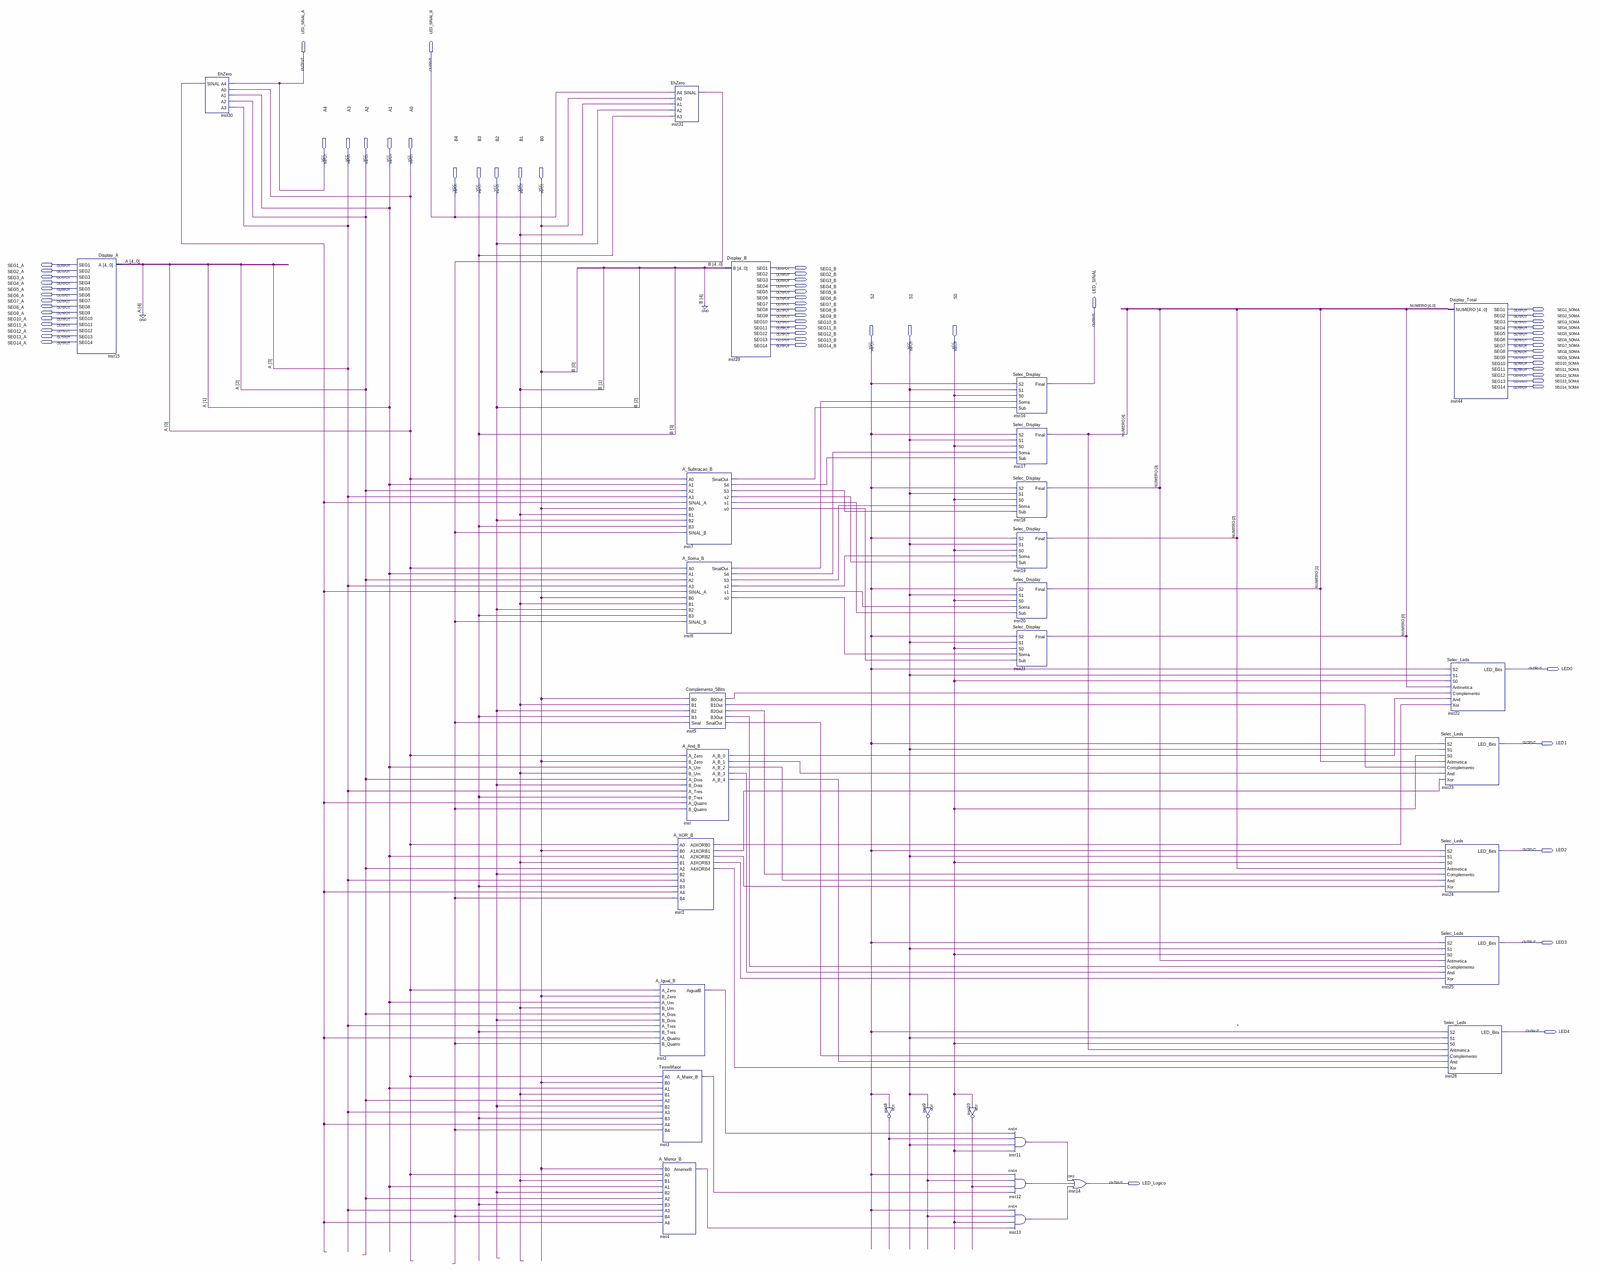
[diagram p0: schematic sheet, whole]
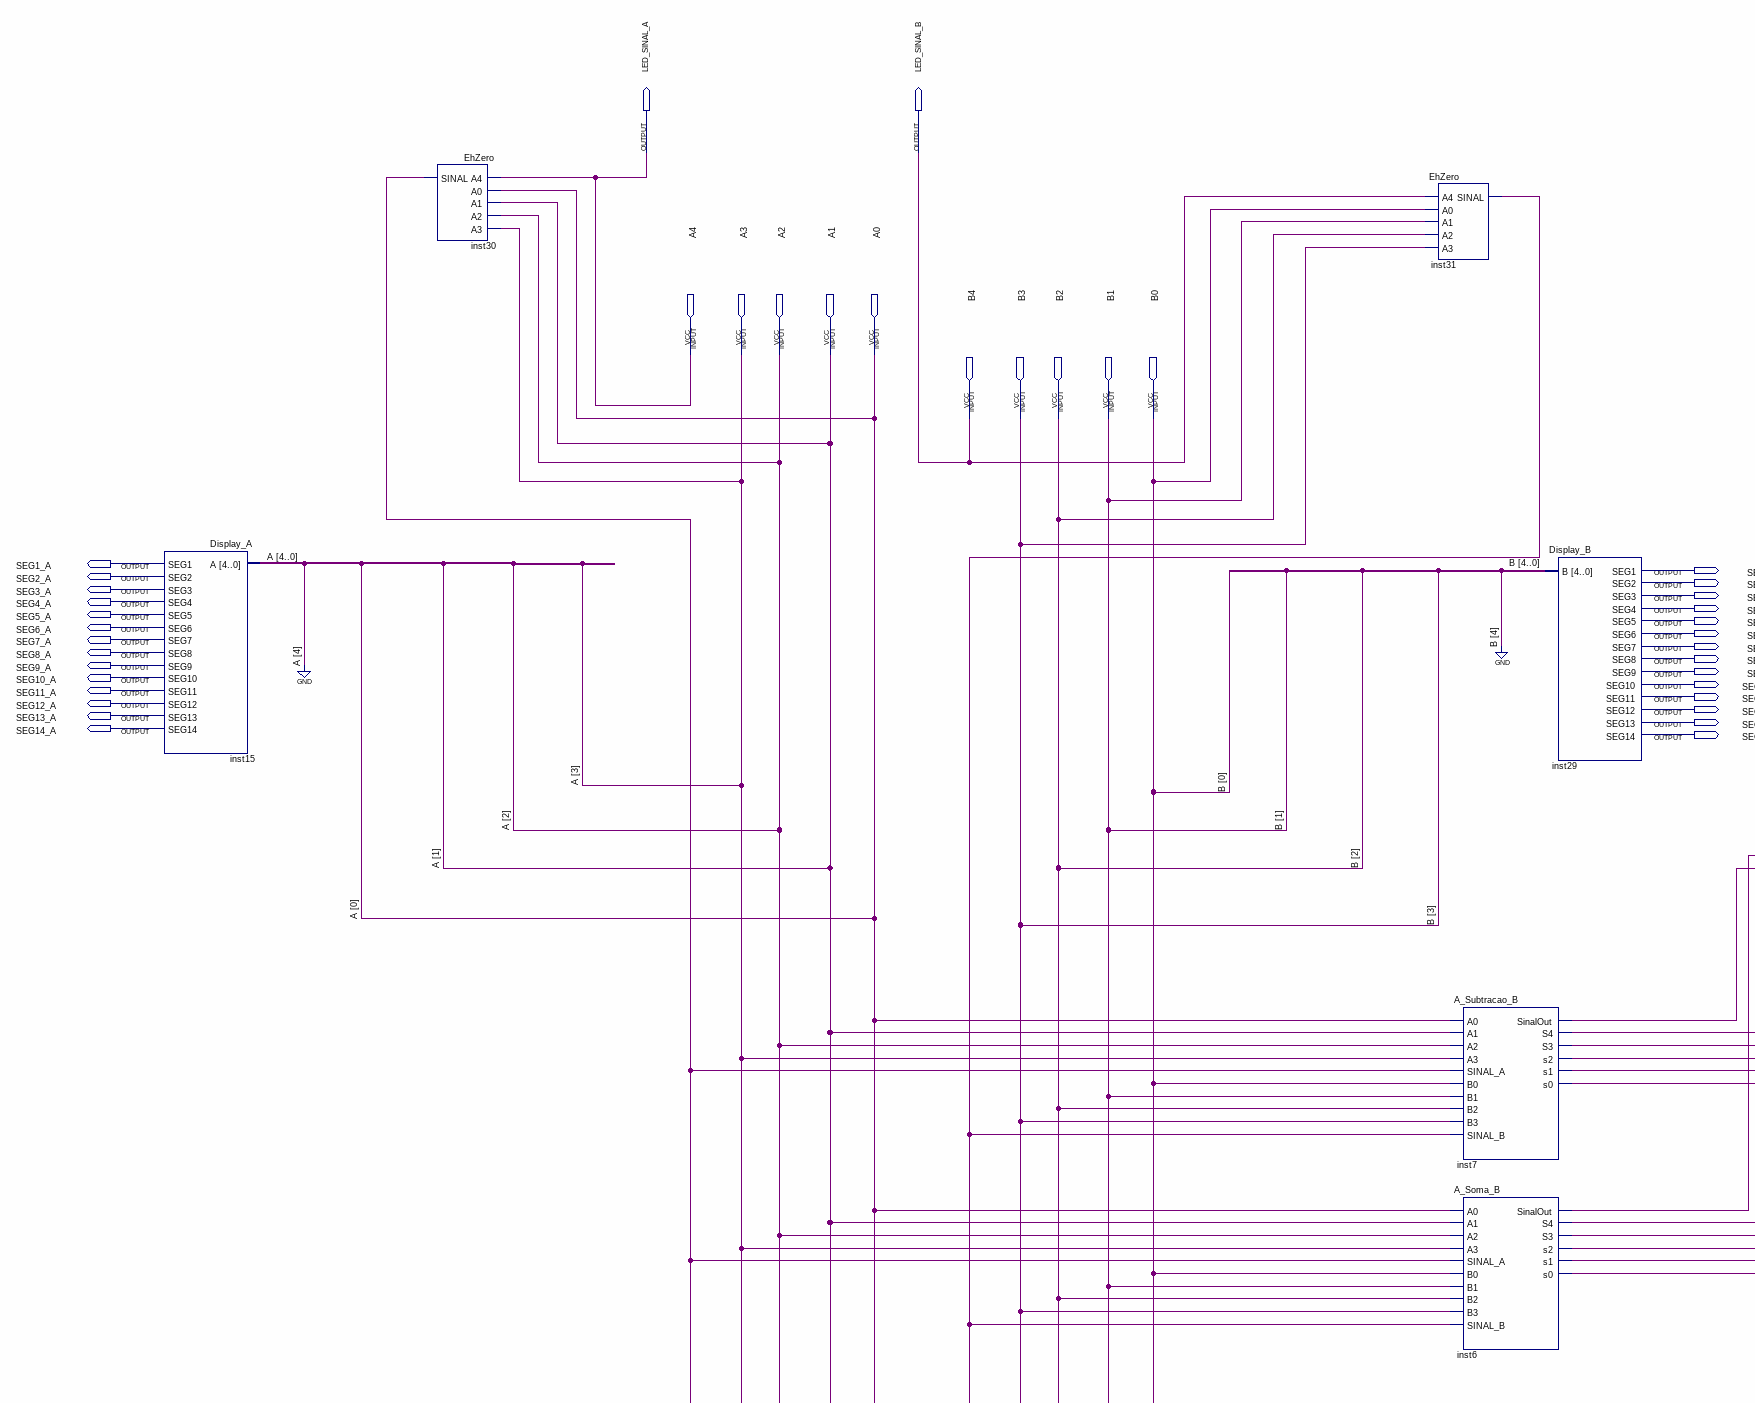
[diagram p1: schematic sheet, upper left part]
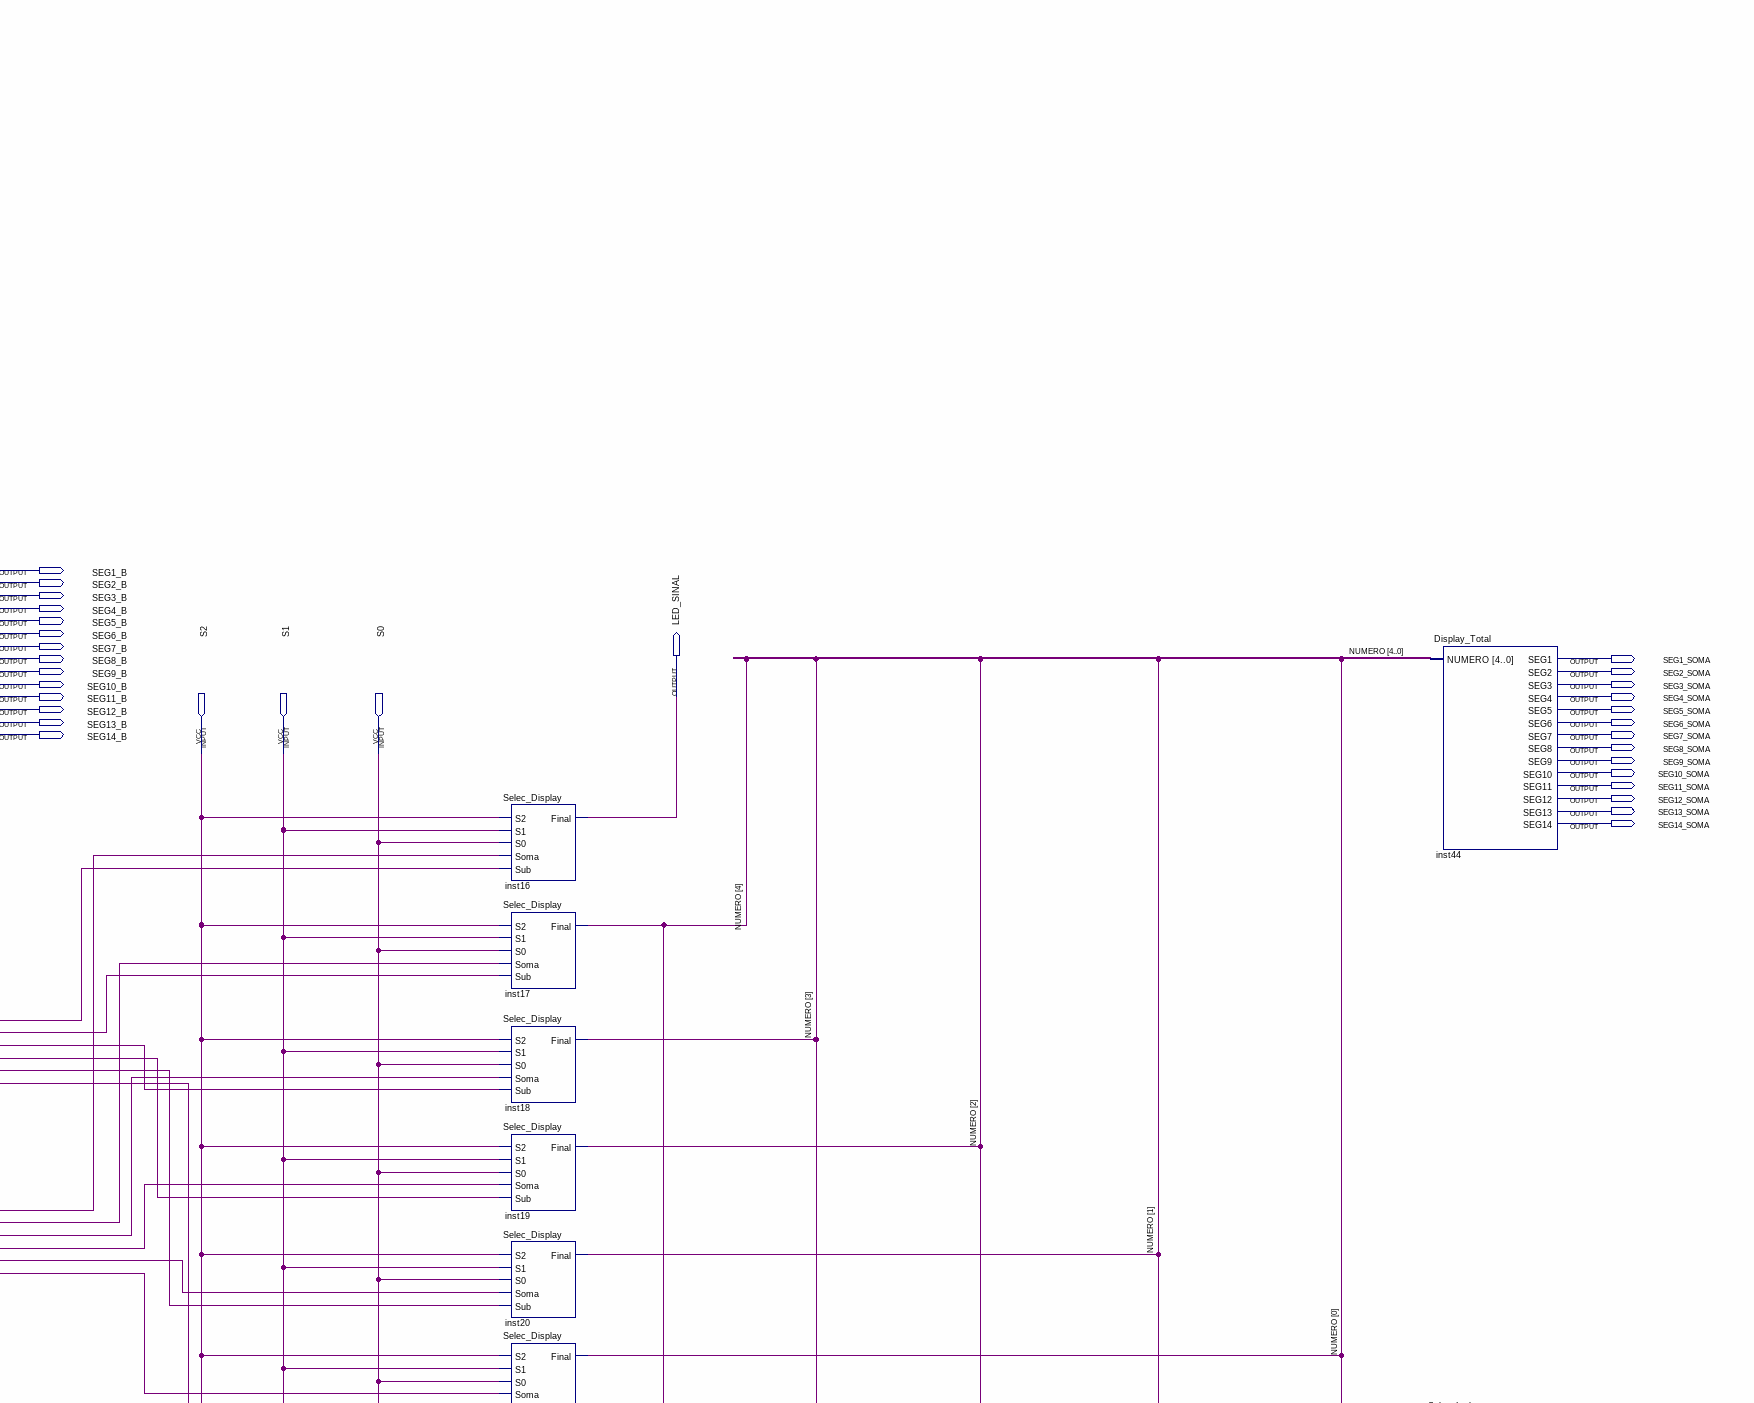
[diagram p2: schematic sheet, upper right part]
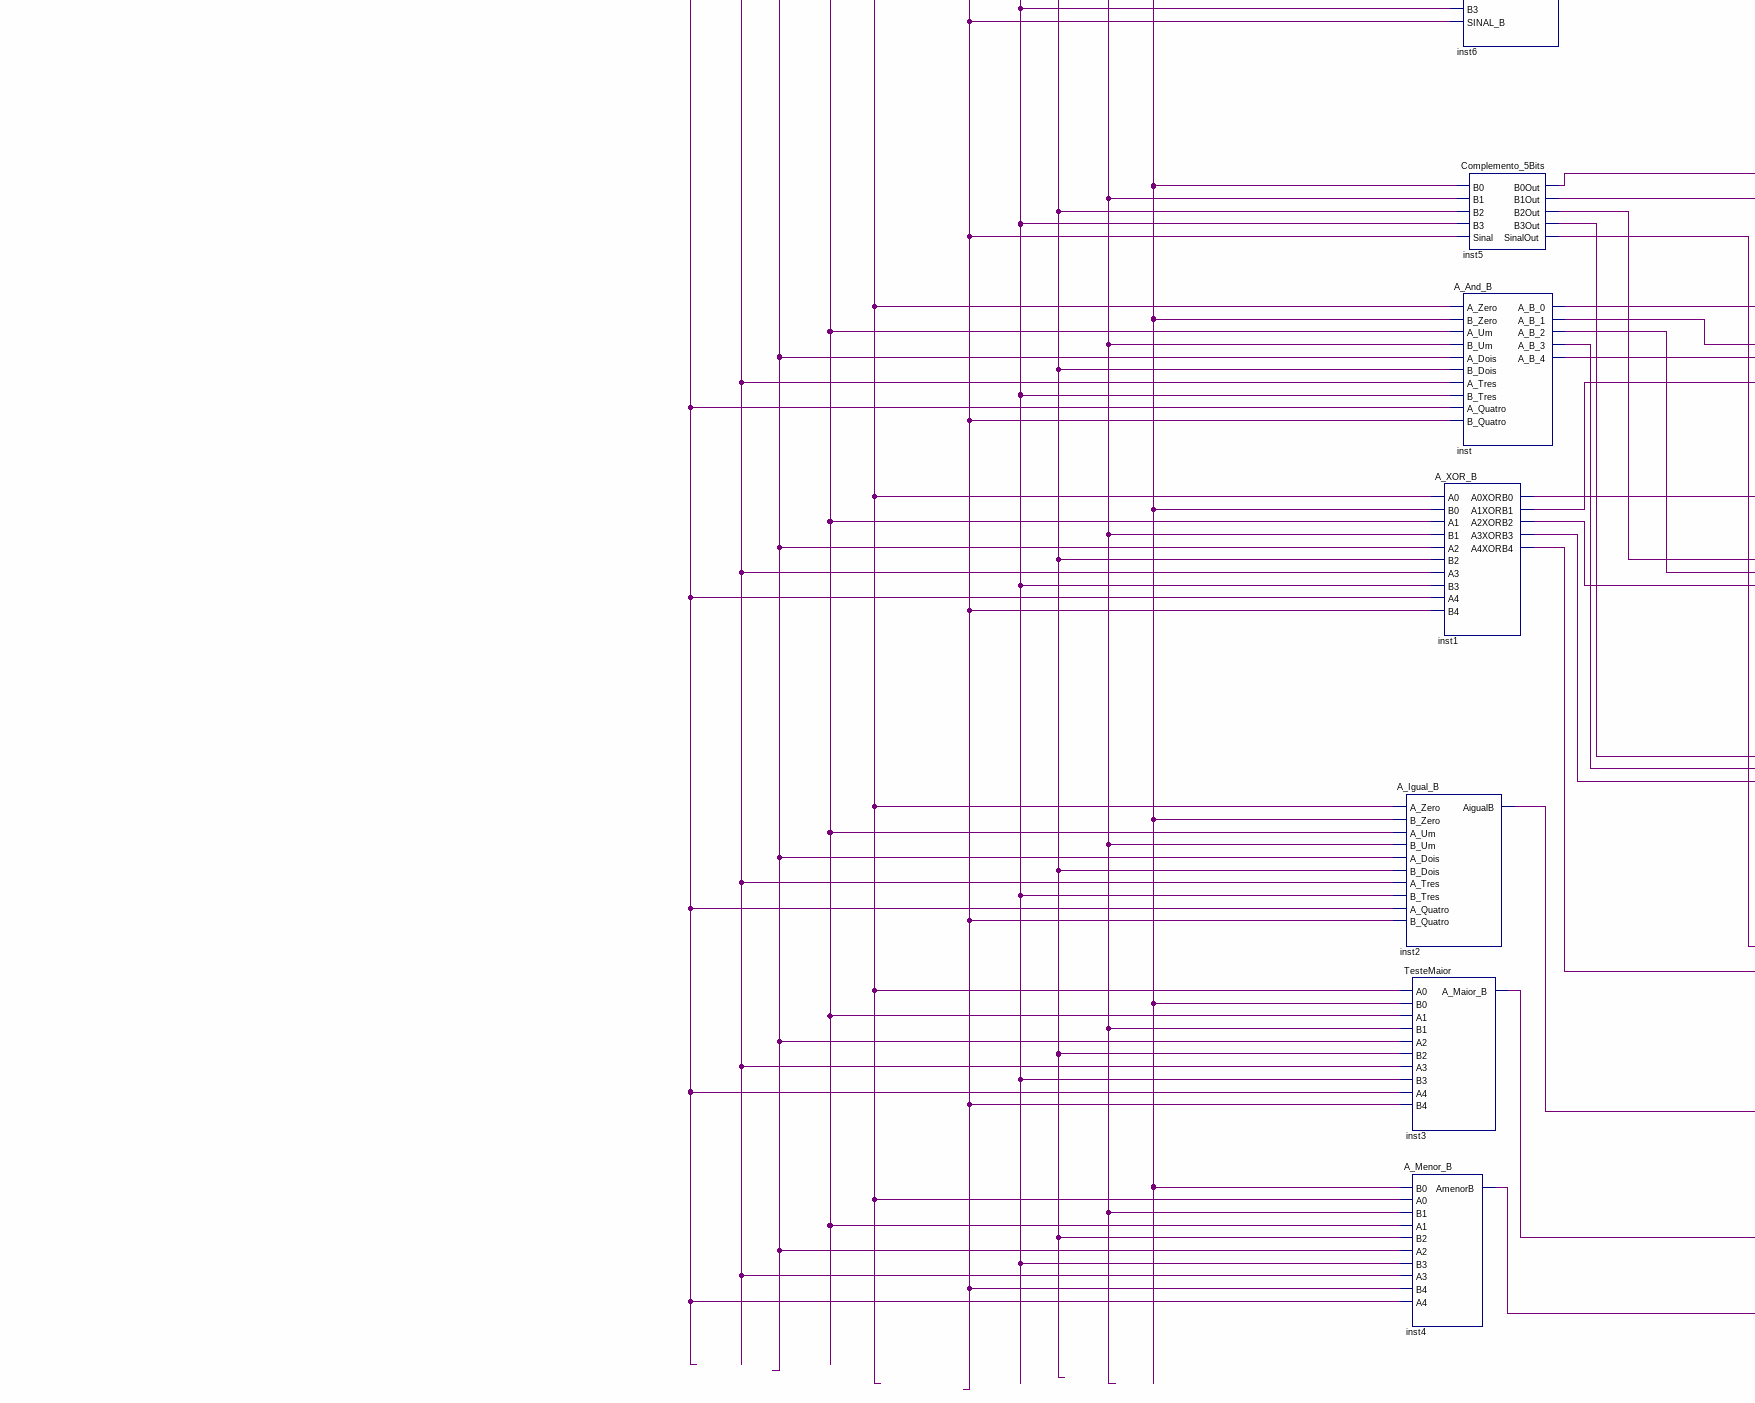
[diagram p3: schematic sheet, lower left part]
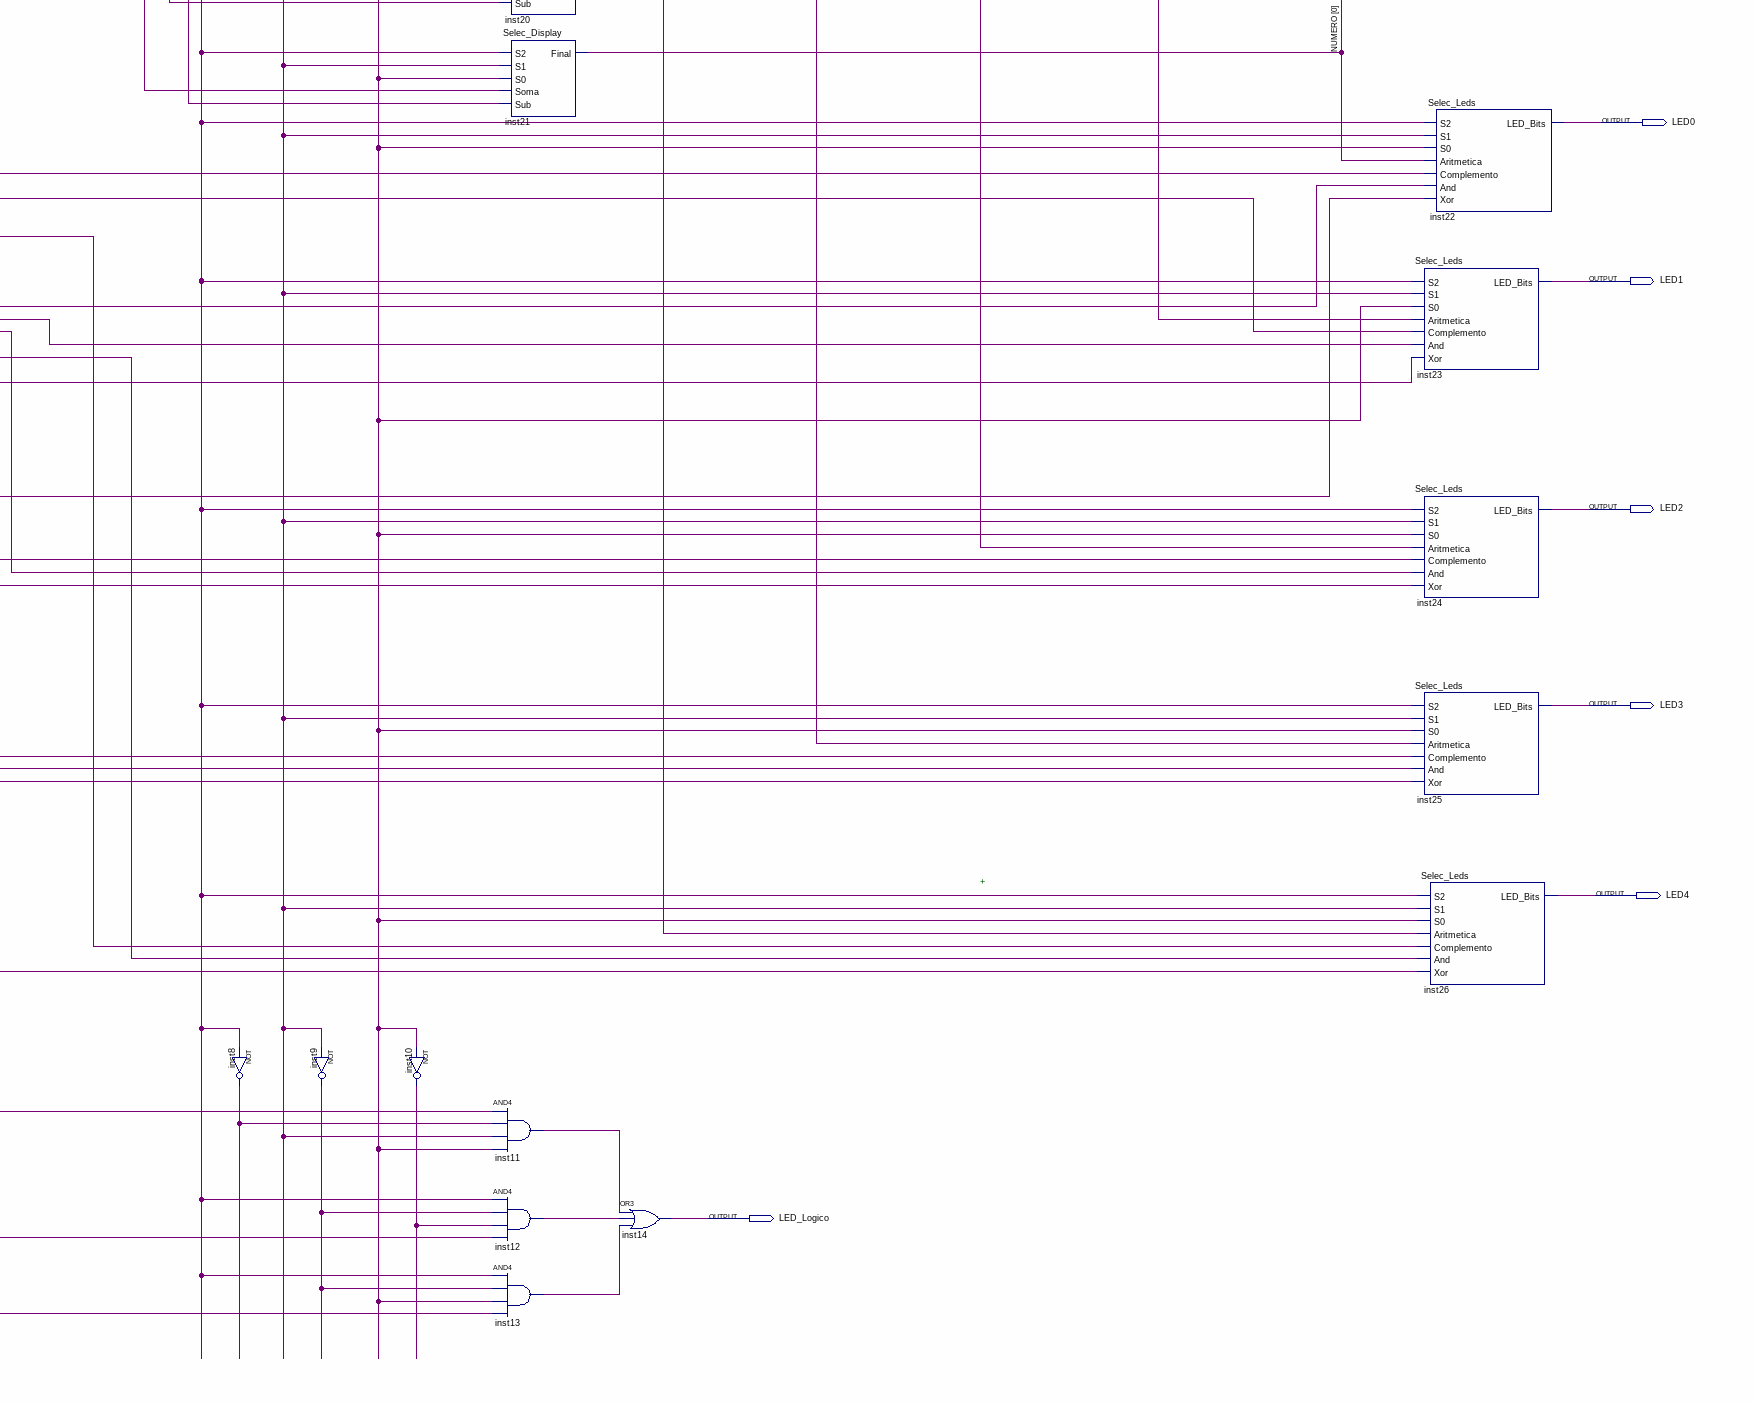
[diagram p4: schematic sheet, lower right part]
// Quartus schematic ULA.bdf as structural Verilog: 31 symbols, 64 pins
module ULA (
  input  A4,
  input  A3,
  input  A2,
  input  A1,
  input  A0,
  input  B4,
  input  B3,
  input  B2,
  input  B1,
  input  B0,
  input  S2,
  input  S1,
  input  S0,
  output LED_SINAL_A,
  output LED_SINAL_B,
  output SEG1_A,
  output SEG1_B,
  output SEG2_A,
  output SEG2_B,
  output SEG3_A,
  output SEG3_B,
  output SEG4_A,
  output SEG4_B,
  output SEG5_A,
  output SEG5_B,
  output SEG6_A,
  output SEG6_B,
  output SEG7_A,
  output SEG7_B,
  output SEG8_A,
  output SEG8_B,
  output SEG1_SOMA,
  output SEG9_A,
  output SEG9_B,
  output SEG2_SOMA,
  output SEG10_A,
  output SEG10_B,
  output SEG3_SOMA,
  output SEG11_A,
  output SEG11_B,
  output LED_SINAL,
  output SEG4_SOMA,
  output SEG12_A,
  output SEG12_B,
  output SEG5_SOMA,
  output SEG13_A,
  output SEG13_B,
  output SEG6_SOMA,
  output SEG14_A,
  output SEG14_B,
  output SEG7_SOMA,
  output SEG8_SOMA,
  output SEG9_SOMA,
  output SEG10_SOMA,
  output SEG11_SOMA,
  output SEG12_SOMA,
  output SEG13_SOMA,
  output SEG14_SOMA,
  output LED0,
  output LED1,
  output LED2,
  output LED3,
  output LED4,
  output LED_Logico
);

  wire inst1_a0xorb0, inst1_a1xorb1, inst1_a2xorb2, inst1_a3xorb3, inst1_a4xorb4, inst2_aigualb,
       inst3_a_maior_b, inst4_amenorb, inst5_b0out, inst5_b1out, inst5_b2out, inst5_b3out, inst5_sinalout,
       inst6_s0, inst6_s1, inst6_s2, inst6_s3, inst6_s4, inst6_sinalout, inst7_s0, inst7_s1, inst7_s2,
       inst7_s3, inst7_s4, inst7_sinalout, inst8_out, inst9_out, inst10_out, inst11_out, inst12_out,
       inst13_out, inst30_sinal, inst31_sinal, inst_a_b_0, inst_a_b_1, inst_a_b_2, inst_a_b_3, inst_a_b_4;
  wire [4:0] NUMERO;

  Display_A inst15 (
    .A({A4, A3, A2, A1, A0}), .SEG1(SEG1_A), .SEG2(SEG2_A), .SEG3(SEG3_A), .SEG4(SEG4_A), .SEG5(SEG5_A),
    .SEG6(SEG6_A), .SEG7(SEG7_A), .SEG8(SEG8_A), .SEG9(SEG9_A), .SEG10(SEG10_A), .SEG11(SEG11_A),
    .SEG12(SEG12_A), .SEG13(SEG13_A), .SEG14(SEG14_A));
  EhZero inst30 (.A4(A4), .A0(A0), .A1(A1), .A2(A2), .A3(A3), .SINAL(inst30_sinal));
  EhZero inst31 (.A4(B4), .A0(B0), .A1(B1), .A2(B2), .A3(B3), .SINAL(inst31_sinal));
  A_XOR_B inst1 (
    .A0(A0), .B0(B0), .A1(A1), .B1(B1), .A2(A2), .B2(B2), .A3(A3), .B3(B3), .A4(inst30_sinal),
    .B4(inst31_sinal), .A0XORB0(inst1_a0xorb0), .A1XORB1(inst1_a1xorb1), .A2XORB2(inst1_a2xorb2),
    .A3XORB3(inst1_a3xorb3), .A4XORB4(inst1_a4xorb4));
  A_Igual_B inst2 (
    .A_Zero(A0), .B_Zero(B0), .A_Um(A1), .B_Um(B1), .A_Dois(A2), .B_Dois(B2), .A_Tres(A3), .B_Tres(B3),
    .A_Quatro(inst30_sinal), .B_Quatro(inst31_sinal), .AigualB(inst2_aigualb));
  TesteMaior inst3 (
    .A0(A0), .B0(B0), .A1(A1), .B1(B1), .A2(A2), .B2(B2), .A3(A3), .B3(B3), .A4(inst30_sinal),
    .B4(inst31_sinal), .A_Maior_B(inst3_a_maior_b));
  A_Menor_B inst4 (
    .B0(B0), .A0(A0), .B1(B1), .A1(A1), .B2(B2), .A2(A2), .B3(B3), .A3(A3), .B4(inst31_sinal),
    .A4(inst30_sinal), .AmenorB(inst4_amenorb));
  A_Subtracao_B inst7 (
    .A0(A0), .A1(A1), .A2(A2), .A3(A3), .SINAL_A(inst30_sinal), .B0(B0), .B1(B1), .B2(B2), .B3(B3),
    .SINAL_B(inst31_sinal), .SinalOut(inst7_sinalout), .S4(inst7_s4), .S3(inst7_s3), .s2(inst7_s2),
    .s1(inst7_s1), .s0(inst7_s0));
  A_Soma_B inst6 (
    .A0(A0), .A1(A1), .A2(A2), .A3(A3), .SINAL_A(inst30_sinal), .B0(B0), .B1(B1), .B2(B2), .B3(B3),
    .SINAL_B(inst31_sinal), .SinalOut(inst6_sinalout), .S4(inst6_s4), .S3(inst6_s3), .s2(inst6_s2),
    .s1(inst6_s1), .s0(inst6_s0));
  Complemento_5Bits inst5 (
    .B0(B0), .B1(B1), .B2(B2), .B3(B3), .Sinal(inst31_sinal), .B0Out(inst5_b0out), .B1Out(inst5_b1out),
    .B2Out(inst5_b2out), .B3Out(inst5_b3out), .SinalOut(inst5_sinalout));
  A_And_B inst (
    .A_Zero(A0), .B_Zero(B0), .A_Um(A1), .B_Um(B1), .A_Dois(A2), .B_Dois(B2), .A_Tres(A3), .B_Tres(B3),
    .A_Quatro(inst30_sinal), .B_Quatro(inst31_sinal), .A_B_0(inst_a_b_0), .A_B_1(inst_a_b_1),
    .A_B_2(inst_a_b_2), .A_B_3(inst_a_b_3), .A_B_4(inst_a_b_4));
  Display_B inst29 (
    .B({B4, B3, B2, B1, B0}), .SEG1(SEG1_B), .SEG2(SEG2_B), .SEG3(SEG3_B), .SEG4(SEG4_B), .SEG5(SEG5_B),
    .SEG6(SEG6_B), .SEG7(SEG7_B), .SEG8(SEG8_B), .SEG9(SEG9_B), .SEG10(SEG10_B), .SEG11(SEG11_B),
    .SEG12(SEG12_B), .SEG13(SEG13_B), .SEG14(SEG14_B));
  not inst8 (inst8_out, S2);
  not inst9 (inst9_out, S1);
  not inst10 (inst10_out, S0);
  and inst11 (inst11_out, inst2_aigualb, inst8_out, S1, S0);
  and inst12 (inst12_out, S2, inst9_out, inst10_out, inst3_a_maior_b);
  and inst13 (inst13_out, S2, inst9_out, S0, inst4_amenorb);
  Selec_Display inst16 (.S2(S2), .S1(S1), .S0(S0), .Soma(inst6_sinalout), .Sub(inst7_sinalout), .Final(LED_SINAL));
  Selec_Display inst17 (.S2(S2), .S1(S1), .S0(S0), .Soma(inst6_s4), .Sub(inst7_s4), .Final(NUMERO[4]));
  Selec_Display inst18 (.S2(S2), .S1(S1), .S0(S0), .Soma(inst6_s3), .Sub(inst7_s3), .Final(NUMERO[3]));
  Selec_Display inst19 (.S2(S2), .S1(S1), .S0(S0), .Soma(inst6_s2), .Sub(inst7_s2), .Final(NUMERO[2]));
  Selec_Display inst20 (.S2(S2), .S1(S1), .S0(S0), .Soma(inst6_s1), .Sub(inst7_s1), .Final(NUMERO[1]));
  Selec_Display inst21 (.S2(S2), .S1(S1), .S0(S0), .Soma(inst6_s0), .Sub(inst7_s0), .Final(NUMERO[0]));
  or inst14 (LED_Logico, inst11_out, inst12_out, inst13_out);
  Display_Total inst44 (
    .NUMERO(NUMERO), .SEG1(SEG1_SOMA), .SEG2(SEG2_SOMA), .SEG3(SEG3_SOMA), .SEG4(SEG4_SOMA),
    .SEG5(SEG5_SOMA), .SEG6(SEG6_SOMA), .SEG7(SEG7_SOMA), .SEG8(SEG8_SOMA), .SEG9(SEG9_SOMA),
    .SEG10(SEG10_SOMA), .SEG11(SEG11_SOMA), .SEG12(SEG12_SOMA), .SEG13(SEG13_SOMA), .SEG14(SEG14_SOMA));
  Selec_Leds inst22 (
    .S2(S2), .S1(S1), .S0(S0), .Aritmetica(NUMERO[0]), .Complemento(inst5_b0out), .And(inst_a_b_0),
    .Xor(inst1_a0xorb0), .LED_Bits(LED0));
  Selec_Leds inst23 (
    .S2(S2), .S1(S1), .S0(S0), .Aritmetica(NUMERO[1]), .Complemento(inst5_b1out), .And(inst_a_b_1),
    .Xor(inst1_a1xorb1), .LED_Bits(LED1));
  Selec_Leds inst24 (
    .S2(S2), .S1(S1), .S0(S0), .Aritmetica(NUMERO[2]), .Complemento(inst5_b2out), .And(inst_a_b_2),
    .Xor(inst1_a2xorb2), .LED_Bits(LED2));
  Selec_Leds inst25 (
    .S2(S2), .S1(S1), .S0(S0), .Aritmetica(NUMERO[3]), .Complemento(inst5_b3out), .And(inst_a_b_3),
    .Xor(inst1_a3xorb3), .LED_Bits(LED3));
  Selec_Leds inst26 (
    .S2(S2), .S1(S1), .S0(S0), .Aritmetica(NUMERO[4]), .Complemento(inst5_sinalout), .And(inst_a_b_4),
    .Xor(inst1_a4xorb4), .LED_Bits(LED4));

  assign LED_SINAL_A = A4;
  assign LED_SINAL_B = B4;
  // also tied to GND on the sheet: {A4, B4}

  // Notes on the sheet:
  //   +
endmodule
